# EAGLE schematic 411Level1 (EAGLE 9.1.3)

## Sheet 1 of 2
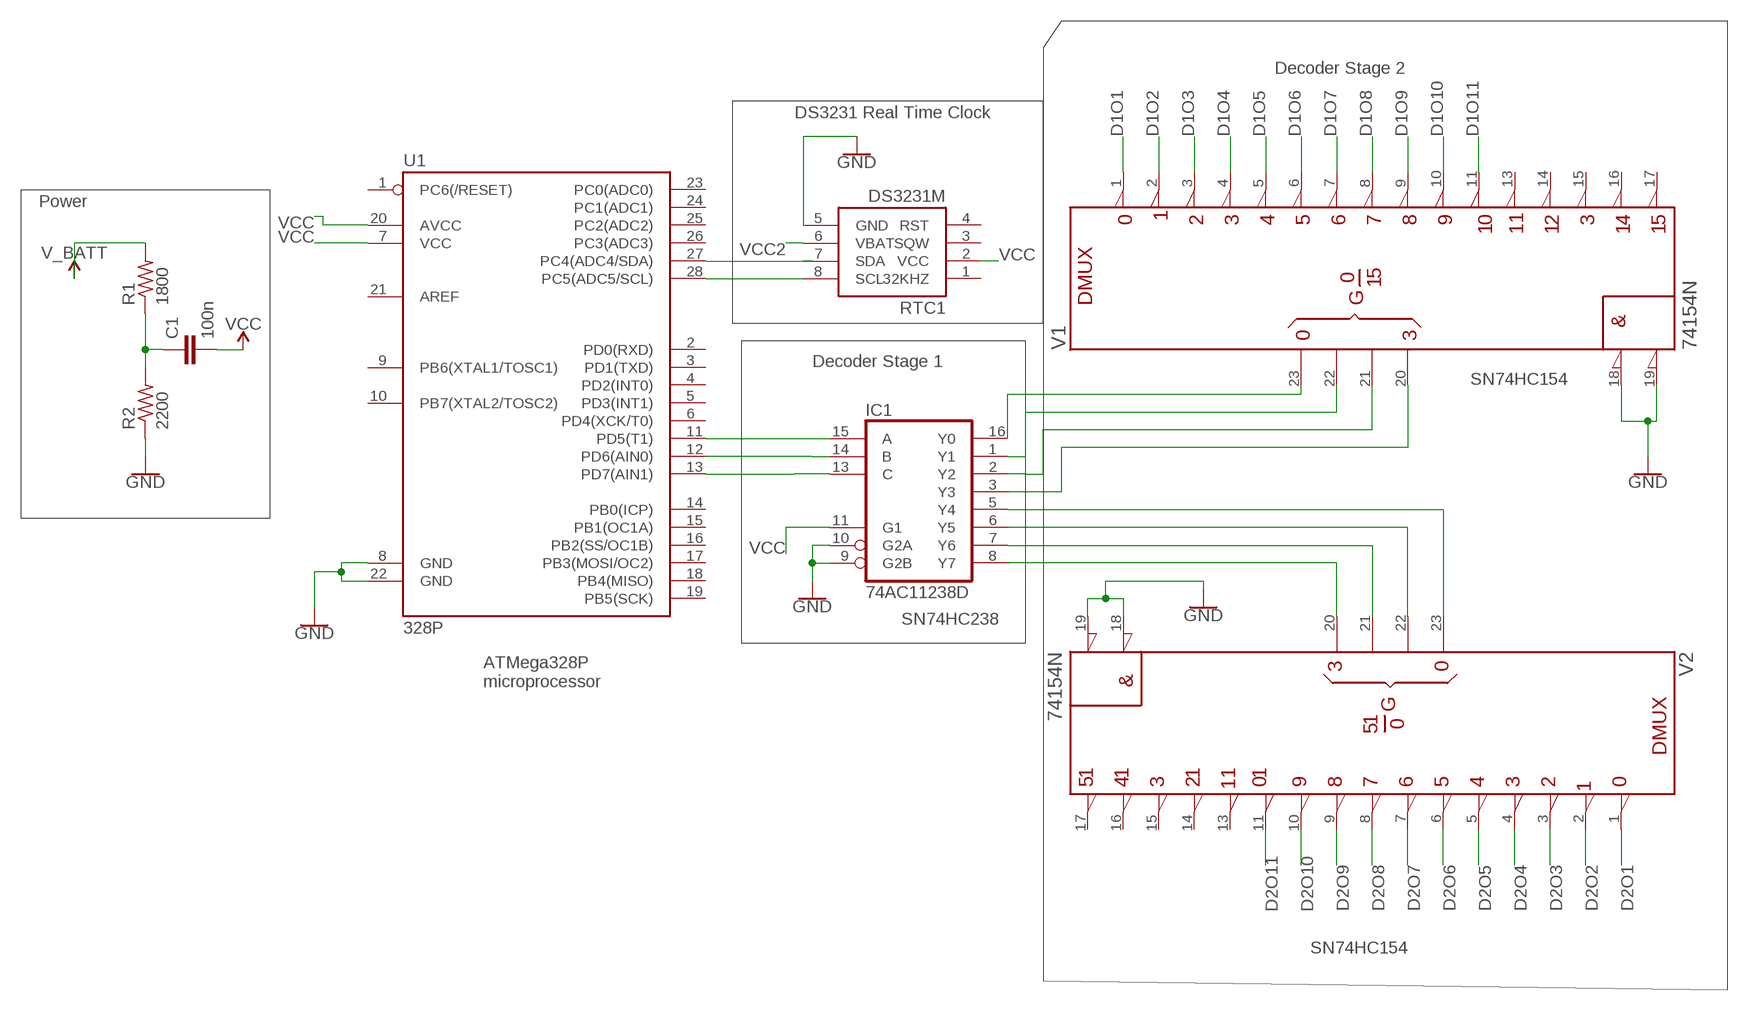
[diagram p0: schematic, sheet 1]

### Parts
C1  100n  C-EU025-025X050  [C025-025X050]
IC1  74AC11238D  [SO16]
R1  1800  R-US_0204/2V  [0204V]
R2  2200  R-US_0204/2V  [0204V]
RTC1  DS3231M  [SO08]
U1  328P  ATMEGA328P_PDIP  [DIP28]
V1  74154N  [DIL24-3]
V2  74154N  [DIL24-3]

### Nets
D1O1: V1.1 ; also sheet 2
D1O2: V1.2 ; also sheet 2
D1O3: V1.3 ; also sheet 2
D1O4: V1.4 ; also sheet 2
D1O5: V1.5 ; also sheet 2
D1O6: V1.6 ; also sheet 2
D1O7: V1.7 ; also sheet 2
D1O8: V1.8 ; also sheet 2
D1O9: V1.9 ; also sheet 2
D1O10: V1.10 ; also sheet 2
D1O11: V1.11 ; also sheet 2
D2O1: V2.1 ; also sheet 2
D2O2: V2.2 ; also sheet 2
D2O3: V2.3 ; also sheet 2
D2O4: V2.4 ; also sheet 2
D2O5: V2.5 ; also sheet 2
D2O6: V2.6 ; also sheet 2
D2O7: V2.7 ; also sheet 2
D2O8: V2.8 ; also sheet 2
D2O9: V2.9 ; also sheet 2
D2O10: V2.10 ; also sheet 2
D2O11: V2.11 ; also sheet 2
GND: IC1.9(G2B) IC1.10(G2A) R2.1 RTC1.5(GND) U1.8(GND) U1.22(GND) V1.18(!G1) V1.19(!G2) V2.18(!G1) V2.19(!G2) ; also sheet 2
N$1: C1.1 R1.1 R2.2
N$2: RTC1.8(SCL) U1.28(PC5(ADC5/SCL))
N$3: RTC1.7(SDA) U1.27(PC4(ADC4/SDA))
N$4: IC1.15(A) U1.11(PD5(T1))
N$5: IC1.1(Y1) V1.22(B)
N$6: IC1.13(C) U1.13(PD7(AIN1))
N$7: IC1.16(Y0) V1.23(A)
N$9: IC1.2(Y2) V1.21(C)
N$11: IC1.3(Y3) V1.20(D)
N$12: IC1.5(Y4) V2.23(A)
N$13: IC1.6(Y5) V2.22(B)
N$14: IC1.7(Y6) V2.21(C)
N$15: IC1.8(Y7) V2.20(D)
N$16: IC1.14(B) U1.12(PD6(AIN0))
V_BATT: R1.2
VCC: C1.2 IC1.11(G1) RTC1.2(VCC) U1.7(VCC) U1.20(AVCC)
VCC2: RTC1.6(VBAT)
Unconnected: RTC1.1(32KHZ) RTC1.3(SQW) RTC1.4(RST) U1.1(PC6(/RESET)) U1.2(PD0(RXD)) U1.3(PD1(TXD)) U1.4(PD2(INT0)) U1.5(PD3(INT1)) U1.6(PD4(XCK/T0)) U1.9(PB6(XTAL1/TOSC1)) U1.10(PB7(XTAL2/TOSC2)) U1.14(PB0(ICP)) U1.15(PB1(OC1A)) U1.16(PB2(SS/OC1B)) U1.17(PB3(MOSI/OC2)) U1.18(PB4(MISO)) U1.19(PB5(SCK)) U1.21(AREF) U1.23(PC0(ADC0)) U1.24(PC1(ADC1)) U1.25(PC2(ADC2)) U1.26(PC3(ADC3)) V1.13 V1.14 V1.15 V1.16 V1.17 V2.13 V2.14 V2.15 V2.16 V2.17

### Notes on the sheet
- Decoder Stage 2
- DS3231 Real Time Clock
- Power
- Decoder Stage 1
- SN74HC154
- SN74HC238
- ATMega328P 
  microprocessor
- SN74HC154

## Sheet 2 of 2
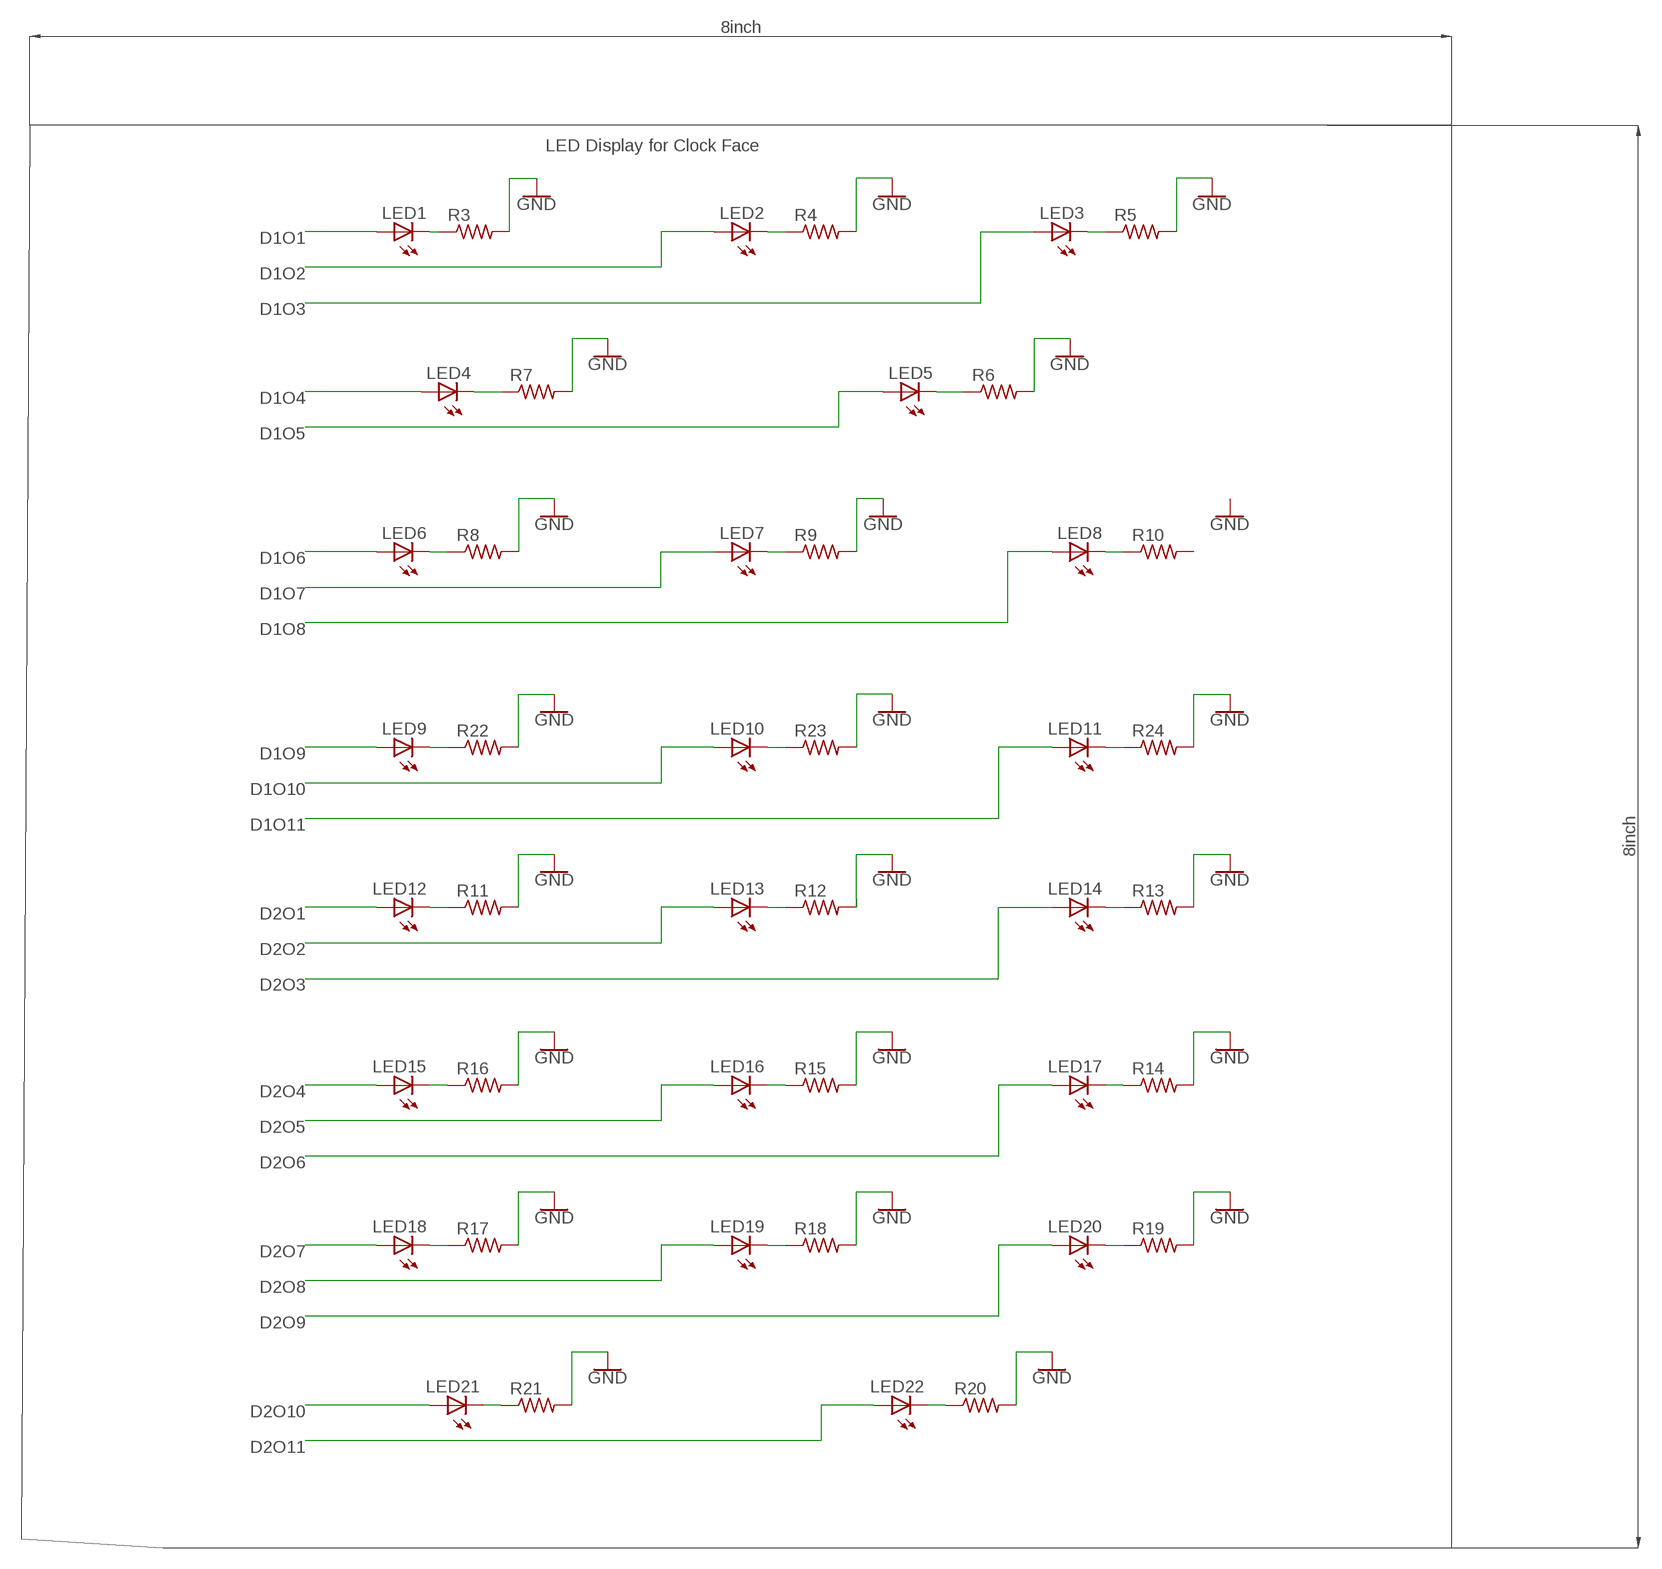
[diagram p1: schematic, sheet 2]

### Parts
LED1  LED5MM  [LED5MM]
LED2  LED5MM  [LED5MM]
LED3  LED5MM  [LED5MM]
LED4  LED5MM  [LED5MM]
LED5  LED5MM  [LED5MM]
LED6  LED5MM  [LED5MM]
LED7  LED5MM  [LED5MM]
LED8  LED5MM  [LED5MM]
LED9  LED5MM  [LED5MM]
LED10  LED5MM  [LED5MM]
LED11  LED5MM  [LED5MM]
LED12  LED5MM  [LED5MM]
LED13  LED5MM  [LED5MM]
LED14  LED5MM  [LED5MM]
LED15  LED5MM  [LED5MM]
LED16  LED5MM  [LED5MM]
LED17  LED5MM  [LED5MM]
LED18  LED5MM  [LED5MM]
LED19  LED5MM  [LED5MM]
LED20  LED5MM  [LED5MM]
LED21  LED5MM  [LED5MM]
LED22  LED5MM  [LED5MM]
R3  R-US_0204/5  [0204/5]
R4  R-US_0204/5  [0204/5]
R5  R-US_0204/5  [0204/5]
R6  R-US_0204/5  [0204/5]
R7  R-US_0204/5  [0204/5]
R8  R-US_0204/5  [0204/5]
R9  R-US_0204/5  [0204/5]
R10  R-US_0204/5  [0204/5]
R11  R-US_0204/5  [0204/5]
R12  R-US_0204/5  [0204/5]
R13  R-US_0204/5  [0204/5]
R14  R-US_0204/5  [0204/5]
R15  R-US_0204/5  [0204/5]
R16  R-US_0204/5  [0204/5]
R17  R-US_0204/5  [0204/5]
R18  R-US_0204/5  [0204/5]
R19  R-US_0204/5  [0204/5]
R20  R-US_0204/5  [0204/5]
R21  R-US_0204/5  [0204/5]
R22  R-US_0204/5  [0204/5]
R23  R-US_0204/5  [0204/5]
R24  R-US_0204/5  [0204/5]

### Nets
D1O1: LED1.A ; also sheet 1
D1O2: LED2.A ; also sheet 1
D1O3: LED3.A ; also sheet 1
D1O4: LED4.A ; also sheet 1
D1O5: LED5.A ; also sheet 1
D1O6: LED6.A ; also sheet 1
D1O7: LED7.A ; also sheet 1
D1O8: LED8.A ; also sheet 1
D1O9: LED9.A ; also sheet 1
D1O10: LED10.A ; also sheet 1
D1O11: LED11.A ; also sheet 1
D2O1: LED12.A ; also sheet 1
D2O2: LED13.A ; also sheet 1
D2O3: LED14.A ; also sheet 1
D2O4: LED15.A ; also sheet 1
D2O5: LED16.A ; also sheet 1
D2O6: LED17.A ; also sheet 1
D2O7: LED18.A ; also sheet 1
D2O8: LED19.A ; also sheet 1
D2O9: LED20.A ; also sheet 1
D2O10: LED21.A ; also sheet 1
D2O11: LED22.A ; also sheet 1
GND: R3.2 R4.2 R5.2 R6.2 R7.2 R8.2 R9.2 R11.2 R12.2 R13.2 R14.2 R15.2 R16.2 R17.2 R18.2 R19.2 R20.2 R21.2 R22.2 R23.2 R24.2 ; also sheet 1
N$26: LED1.K(C) R3.1
N$38: LED2.K(C) R4.1
N$39: LED3.K(C) R5.1
N$40: LED5.K(C) R6.1
N$41: LED4.K(C) R7.1
N$42: LED6.K(C) R8.1
N$43: LED7.K(C) R9.1
N$44: LED8.K(C) R10.1
N$45: LED9.K(C) R22.1
N$46: LED10.K(C) R23.1
N$47: LED11.K(C) R24.1
N$48: LED12.K(C) R11.1
N$49: LED13.K(C) R12.1
N$50: LED14.K(C) R13.1
N$51: LED17.K(C) R14.1
N$52: LED16.K(C) R15.1
N$53: LED15.K(C) R16.1
N$54: LED18.K(C) R17.1
N$55: LED19.K(C) R18.1
N$56: LED20.K(C) R19.1
N$57: LED22.K(C) R20.1
N$58: LED21.K(C) R21.1
Unconnected: R10.2

### Notes on the sheet
- LED Display for Clock Face

## Power pins joined to a net without a drawn wire
+UB: V1.24(+UB) V2.24(+UB)
-UB: V1.12(-UB) V2.12(-UB)
GND: IC1.4(GND)
VCC: IC1.12(VCC)

## Library data of the parts
C1 = resistor:C-EU: CAPACITOR, European symbol
IC1 = 74ac-logic:74AC11238: 3 to 8 line DECODER/DEMULTIPLEXER
LED1-LED22 = led:LED: LED OSRAM: - CHIPLED LG R971, LG N971, LY N971, LG Q971, LY Q971, LO R971, LY R971 LH N974, LH R974 LS Q976, LO Q976, LY Q976 LO Q996 - Hyper CHIPLED LW Q18S LB Q993, LB Q99A, LB R99A - SideLED LS A670, LO A670, LY A670, LG A670, LP A670 LB A673, LV A673, LT A673, LW A673 LH A674 LY A675 LS A676, LA A676, LO A676, LY A676, LW A676 LS A679, LY A679, LG A679 - Hyper Micro SIDELED® LS Y876, LA Y876, LO Y876, LY Y876 LT Y87S - SmartLED LW L88C, LW L88S LB L89C, LB L89S, LG L890 LS L89K, LO L89K, LY L89K LS L896, LA L896, LO L896, LY L896 - TOPLED LS T670, LO T670, LY T670, LG T670, LP T670 LSG T670, LSP T670, LSY T670, LOP T670, LYG T670 LG T671, LOG T671, LSG T671 LB T673, LV T673, LT T673, LW T673 LH T674 LS T676, LA T676, LO T676, LY T676, LB T676, LH T676, LSB T676, LW T676 LB T67C, LV T67C, LT T67C, LS T67K, LO T67K, LY T67K, LW E67C LS E67B, LA E67B, LO E67B, LY E67B, LB E67C, LV E67C, LT E67C LW T67C LS T679, LY T679, LG T679 LS T770, LO T770, LY T770, LG T770, LP T770 LB T773, LV T773, LT T773, LW T773 LH T774 LS E675, LA E675, LY E675, LS T675 LS T776, LA T776, LO T776, LY T776, LB T776 LHGB T686 LT T68C, LB T68C - Hyper Mini TOPLED® LB M676 - Mini TOPLED Santana® LG M470 LS M47K, LO M47K, LY M47K Source: http://www.osram.convergy.de LUXEON: - LUMILED® LXK2-PW12-R00, LXK2-PW12-S00, LXK2-PW14-U00, LXK2-PW14-V00 LXK2-PM12-R00, LXK2-PM12-S00, LXK2-PM14-U00 LXK2-PE12-Q00, LXK2-PE12-R00, LXK2-PE12-S00, LXK2-PE14-T00, LXK2-PE14-U00 LXK2-PB12-K00, LXK2-PB12-L00, LXK2-PB12-M00, LXK2-PB14-N00, LXK2-PB14-P00, LXK2-PB14-Q00 LXK2-PR12-L00, LXK2-PR12-M00, LXK2-PR14-Q00, LXK2-PR14-R00 LXK2-PD12-Q00, LXK2-PD12-R00, LXK2-PD12-S00 LXK2-PH12-R00, LXK2-PH12-S00 LXK2-PL12-P00, LXK2-PL12-Q00, LXK2-PL12-R00 Source: www.luxeon.com KINGBRIGHT: KA-3528ASYC Source: www.kingbright.com
R1-R24 = resistor:R-US_: RESISTOR, American symbol
RTC1 = SparkFun-Clocks:DS3231M: DS3231M Real Time Clock Accuracy +/-5ppm. Battery Backup. 2.3V to 5.5V. Datasheet <https://cdn.sparkfun.com/datasheets/Dev/Beagle/DS3231M.pdf> SparkFun Products CryptoCape <https://www.sparkfun.com/products/12773> (DEV-12773) SparkFun CryptoShield <https://www.sparkfun.com/products/13183> (DEV-13183); PROD_ID: IC-11985
U1 = SparkFun-IC-Microcontroller:ATMEGA328P_PDIP: Atmel 328P Through hole ATMEGA328P uC used in the Arduino 32kb flash, 1k EEPROM, 2k SRAM Datasheet <http://www.sparkfun.com/datasheets/Components/SMD/ATMega328.pdf> SparkFun Products Storefront component: AVR 28 Pin 20MHz 32K 6A/D - ATMega328P <https://www.sparkfun.com/products/9061> (COM-09061) SparkFun Simon Says - Through-Hole Soldering Kit <https://www.sparkfun.com/products/10547> (KIT-10547) SparkFun Learn to Solder - Simon Says <https://www.sparkfun.com/products/13708> (KIT-13708) SparkFun BigTime Watch Kit <https://www.sparkfun.com/products/11734> (KIT-11734) SparkFun ClockIt <https://www.sparkfun.com/products/10930> (KIT-10930) SparkFun Serial Enabled LCD Kit <https://www.sparkfun.com/products/10097> (LCD-10097) SparkFun Simon Tilts - Through Hole Soldering Kit <https://www.sparkfun.com/products/12634> (KIT-12634) SparkFun Frequency Counter Kit <https://www.sparkfun.com/products/10140> (KIT-10140) FabFM Radio Kit <https://www.sparkfun.com/products/11043> (KIT-11043) SparkFun Binary Blaster Kit <https://www.sparkfun.com/products/12037> (KIT-12037) SparkFun Metro-Gnome <https://www.sparkfun.com/products/9236> (KIT-09236) ATmega328 with Arduino Optiboot (Uno) <https://www.sparkfun.com/products/10524> (DEV-10524); PROD_ID: IC-09136
V1 V2 = 74ttl-din:74*154: 4-line to 16-line data SELECTOR/MULTIPLEXER